# EAGLE design bme280_ssd1306 (EAGLE 9.6.2)
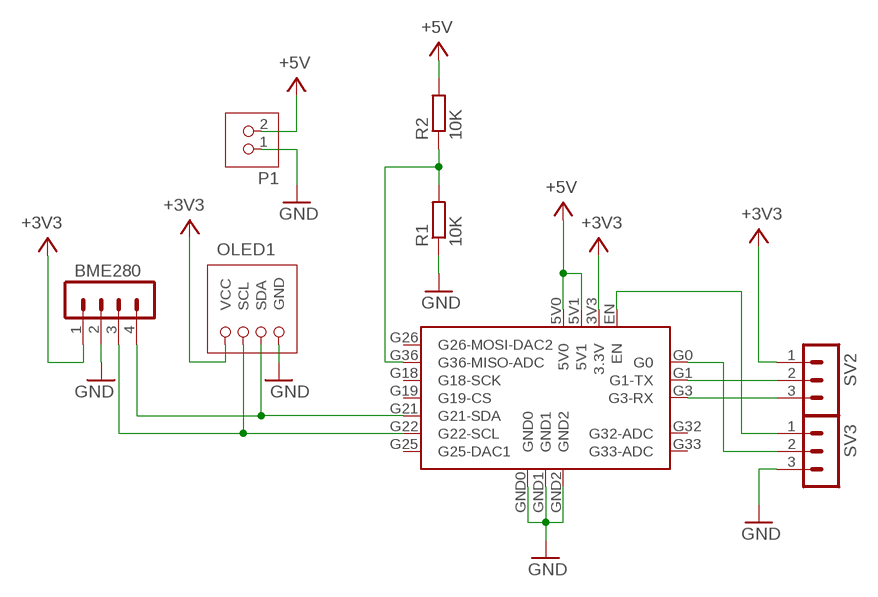
[diagram p0: schematic, sheet 1]

## Parts
BME280  PINHEAD-MA04-1  [PINHEAD-MA04-1]
M5PICO1  M5STAMP-PICO-SMD  [M5STAMP-PICO-SMD]
OLED1  OLED-SSD1306-0.96  [OLED-I2C-0.96]
P1  JST-PH2  [JST-PH2]
R1  10K  R-EU_R3216  [R3216]
R2  10K  R-EU_R3216  [R3216]
SV2  PINHEAD-MA03-1  [PINHEAD-MA03-1]
SV3  PINHEAD-MA03-1  [PINHEAD-MA03-1]

## Nets
+3V3: BME280.1 M5PICO1.3V3(3.3V) OLED1.VCC SV2.1
+5V: M5PICO1.5V0 M5PICO1.5V1 P1.2 R2.2
GND: BME280.2 M5PICO1.GND0 M5PICO1.GND1 M5PICO1.GND2 OLED1.GND P1.1 R1.1 SV3.3
N$1: M5PICO1.G1(G1-TX) SV2.2
N$2: M5PICO1.G3(G3-RX) SV2.3
N$3: M5PICO1.EN SV3.1
N$4: M5PICO1.G0 SV3.2
N$5: BME280.4 M5PICO1.G21(G21-SDA) OLED1.SDA
N$6: BME280.3 M5PICO1.G22(G22-SCL) OLED1.SCL
N$7: M5PICO1.G36(G36-MISO-ADC) R1.2 R2.1
Unconnected: M5PICO1.G18(G18-SCK) M5PICO1.G19(G19-CS) M5PICO1.G25(G25-DAC1) M5PICO1.G26(G26-MOSI-DAC2) M5PICO1.G32(G32-ADC) M5PICO1.G33(G33-ADC)

## Library data of the parts
BME280 = ytani1:PINHEAD-MA04-1: PIN HEADER; OC_FARNELL: unknown; OC_NEWARK: unknown
M5PICO1 = ytani1:M5STAMP-PICO: M5Stamp Pico
OLED1 = ytani1:OLED-SSD1306-0.96: OLED SSD1306 0.96inch 128x96 I2C https://akizukidenshi.com/catalog/g/gP-12031/ Vcc: 3V-5.5V I2C addr: 0x3C Control chip: SSD1306 Blank/White; OC_AKIZUKI: P-12031; URL_AKIZUKI: https://akizukidenshi.com/catalog/g/gP-12031/
P1 = ytani1:JST-PH2
R1 R2 = rcl:R-EU_: RESISTOR, European symbol; SPICEPREFIX: R
SV2 SV3 = ytani1:PINHEAD-MA03-1: PIN HEADER; OC_FARNELL: unknown; OC_NEWARK: unknown

## Board
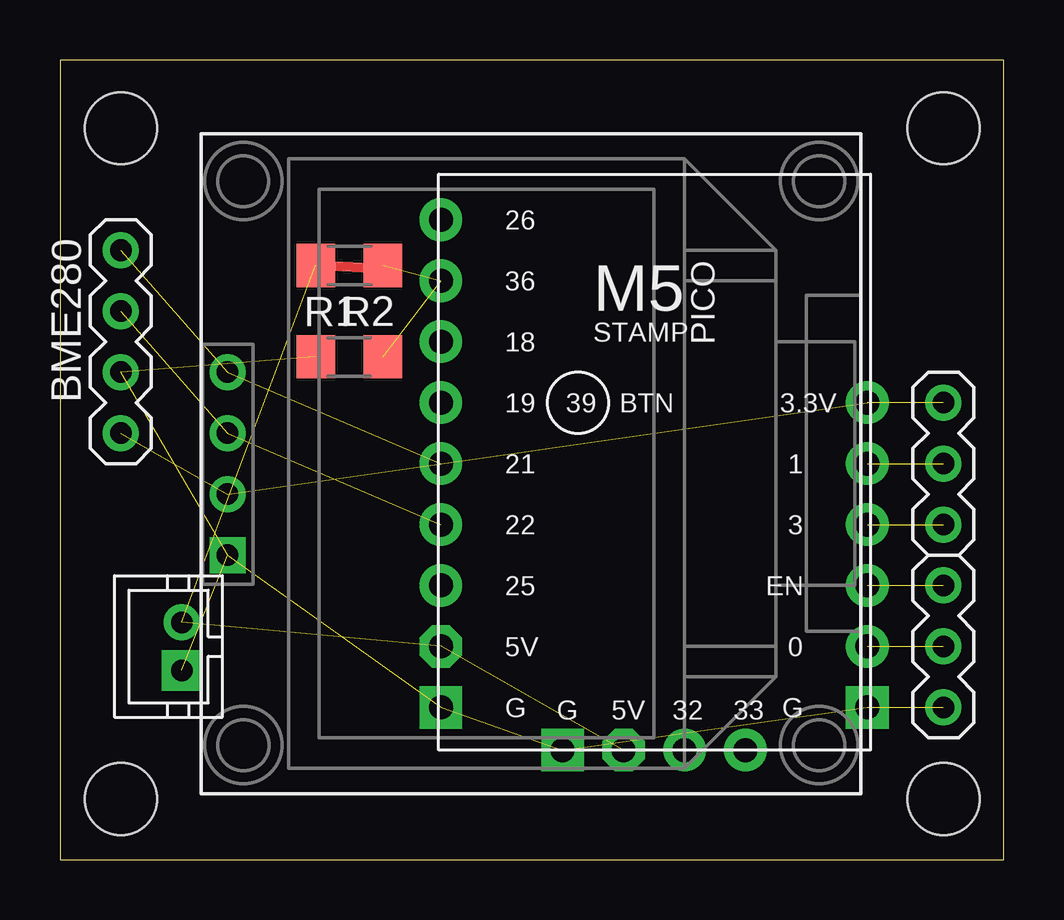
[diagram p1: board, top side]

Size 39.35 x 33.33 mm. Coordinates in mm from the lower left corner, seen from the top.
Outline: 0,0 39.35,0 39.35,33.33 0,33.33 0,0
Copper layers (1*16): Top 0.035mm / dielectric 1.5mm / Bottom 0.035mm
Design rules "default": minimum track width 6mil, minimum drill 0.35mm, track to track 6mil, track to pad 6mil, pad to pad 6mil, via to via 6mil, smd to smd 6mil, copper to edge 40mil, drill to drill 6mil, minimum pad ring 10mil, minimum via ring 8mil, stop-mask expansion 4mil, vias tented up to drill 0mil, thermal gap 10mil
Holes 3 mm at 2.54,30.48 36.83,30.48 36.83,2.54 2.54,2.54

### Footprints (pad centres in the part's own frame; a part is rotated, then mirrored left to right if it is on the bottom)
PINHEAD-MA04-1 = drill 0.9 pad 1.5: 1 -3.81,0; 2 -1.27,0; 3 1.27,0; 4 3.81,0
M5STAMP-PICO-SMD = drill 1 pad 1.778: 3V3 8.89,2.54; EN 8.89,-5.08; G0 8.89,-7.62; G1 8.89,0; G3 8.89,-2.54; G18 -8.89,5.08; G19 -8.89,2.54; G21 -8.89,0; G22 -8.89,-2.54; G25 -8.89,-5.08; G26 -8.89,10.16; G32 1.27,-11.935; G33 3.81,-11.935; G36 -8.89,7.62 | drill 1 pad 1.778 octagon: 5V0 -1.27,-11.935; 5V1 -8.89,-7.62 | drill 1 pad 1.778 square: GND0 -3.81,-11.935; GND1 -8.89,-10.16; GND2 8.89,-10.16
OLED-I2C-0.96 = drill 0.9 pad 1.5 square: GND -5.08,10.16 | drill 0.9 pad 1.5: SCL 0,10.16; SDA 2.54,10.16; VCC -2.54,10.16
JST-PH2 = drill 0.9 pad 1.676 square: 1 -1,0 | drill 0.9 pad 1.5: 2 1,0
R3216 = smd 1.6 x 1.8: 1 -1.4,0; 2 1.4,0
PINHEAD-MA03-1 = drill 0.9 pad 1.5: 1 -1.27,0; 2 1.27,0; 3 3.81,0

### Placement (x,y rotation side)
BME280  2.54,21.59 90 top
M5PICO1  24.77,16.51 0 top
OLED1  17.14,17.78 90 top
P1  5.08,8.89 90 top
R1  12.06,20.95 0 top
R2  12.06,24.77 180 top
SV2  36.83,17.78 270 top
SV3  36.83,10.16 270 top

### Tracks (layer width: path | path; a pad name or v marks a point on that pad's centre or on a via)
+3V3  (3 unrouted)
+5V  (3 unrouted)
  Top 0.406: 13.34,24.64 R2.2
GND  (7 unrouted)
N$1  (1 unrouted)
N$2  (1 unrouted)
N$3  (1 unrouted)
N$4  (1 unrouted)
N$5  (2 unrouted)
N$6  (2 unrouted)
N$7  (2 unrouted)